# Altium schematic sheet Cascade.SchDoc
size A; SheetNumber: 8; SheetTotal: 9
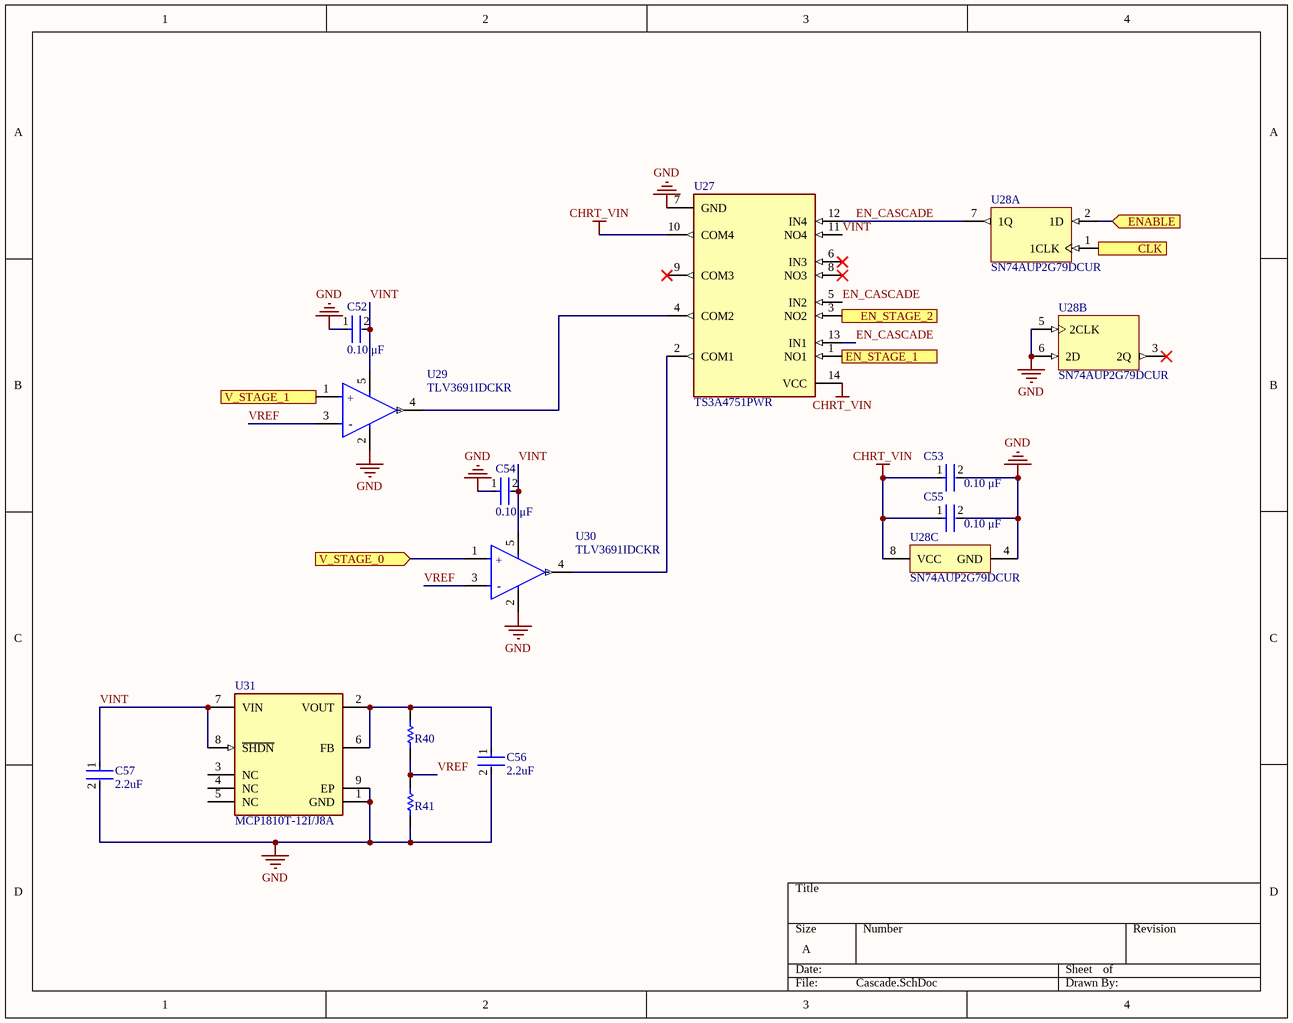
[diagram p0: Cascade.SchDoc]

## Parts
C52  Capacitance: 0.10 μF  [FP-C0402-BB-MFG]  (hidden comment: C0402C104K8PACTU)
C53  Capacitance: 0.10 μF  [FP-C0402-BB-MFG]  (hidden comment: C0402C104K8PACTU)
C54  Capacitance: 0.10 μF  [FP-C0402-BB-MFG]  (hidden comment: C0402C104K8PACTU)
C55  Capacitance: 0.10 μF  [FP-C0402-BB-MFG]  (hidden comment: C0402C104K8PACTU)
C56  Capacitance: 2.2uF  [FP-GRM188-0_1-e0_2_0_5-MFG]  (hidden comment: GRM188R71A225KE15D)
C57  Capacitance: 2.2uF  [FP-GRM188-0_1-e0_2_0_5-MFG]  (hidden comment: GRM188R71A225KE15D)
R40  ERJ-2GEJ915X  [RESC1005X40X25LL05T05]  (value not drawn)
R41  CRCW04022M40FKED  [RESC1005X40X25LL05T05]  (value not drawn)
U27  TS3A4751PWR  [FP-PW0014A-IPC_C]
U28  SN74AUP2G79DCUR  [DCU0008A_L]  (parts A,B,C of 3)
U29  TLV3691IDCKR  [FP-DCK0005A-IPC_A]
U30  TLV3691IDCKR  [FP-DCK0005A-IPC_A]
U31  MCP1810T-12I/J8A  [FP-C04-1207A-MFG]

## Ports
CLK (in), EN_STAGE_1 (in), EN_STAGE_2 (in), ENABLE (in), V_STAGE_0 (in), V_STAGE_1 (in)

## Nets
CHRT_VIN: C53.1 C55.1 U27.10(COM4) U27.14(VCC) U28.8(VCC)
GND: C52.1 C53.2 C54.1 C55.2 C56.2 C57.2 R41.2 U27.7(GND) U28.4(GND) U28.5(2CLK) U28.6(2D) U29.2(GND) U30.2(GND) U31.1(GND) U31.9(EP)
CLK: U28.1(1CLK) ; port CLK
EN_CASCADE: U27.5(IN2) U27.12(IN4) U27.13(IN1) U28.7(1Q)
EN_STAGE_1: U27.1(NO1) ; port EN_STAGE_1
EN_STAGE_2: U27.3(NO2) ; port EN_STAGE_2
ENABLE: U28.2(1D) ; port ENABLE
V_STAGE_0: U30.1(IN+) ; port V_STAGE_0
V_STAGE_1: U29.1(IN+) ; port V_STAGE_1
VINT: C52.2 C54.2 C57.1 U27.11(NO4) U29.5(VCC) U30.5(VCC) U31.7(VIN) U31.8(~{SHDN})
VREF: R40.1 R41.1 U29.3(IN-) U30.3(IN-)
NetC56_1: C56.1 R40.2 U31.2(VOUT) U31.6(FB)
NetU27_2: U27.2(COM1) U30.4(OUT)
NetU27_4: U27.4(COM2) U29.4(OUT)

Not connected (* = marked no-connect by the designer): U27 6(IN3)* 8(NO3)* 9(COM3)*; U28 3(2Q)*; U31 3(NC) 4(NC) 5(NC)

## Notes on the sheet
- (in symbol CMP-04896-000044-1) +; -

## Library data of the parts
C52-C55 = CMP-2008-02046-2: CAP CER 0.1UF 10V X5R 0402; Manufacturer: Kemet; Material: Ceramic; Temperature Coefficient: 15%; Tolerance: 0.1; Value: 0.10 μF; Package: C0402-BB; Temperature: -55°C to +125°C; ComponentLink2Description: Datasheet; Temperature Characteristic: X5R; Device Class L1: Passive Components; Height: 0.55mm; Lead Free: Yes; ComponentLink2URL: https://content.kemet.com/datasheets/KEM_C1002_X7R_SMD.pdf; Device Class L2: Capacitors; Temperature Range Low: -55°C; Temperature Range High: +125°C; RoHS: TRUE; Octopart: https://octopart.com/c0402c104k8pactu-kemet-140039; Automotive: No; Mouser Description: Capacitor 100 nF 10 VDC 0402; Category: Cap; Voltage Rating: 10 V; Digikey Description: CAP CER 0.1UF 10V X5R 0402; Ipc Land Pattern Name: CAPC10050X50; Device Class L3: Ceramic Capacitors; Manufacturer Part Number: C0402C104K8PACTU
C56 C57 = CMP-2006-02836-2: Chip Multilayer Ceramic Capacitors for General Purpose, 0603, 2.2uF, X7R, 15%, 10%, 10V; Case Code (Metric): 1608; Height: 0.8mm; Packaging: Cut Tape; Voltage: 10V; Lead Free: Lead Free; Min Operating Temperature: -55°C; Voltage Rating (DC): 10V; Max Operating Temperature: 125°C; Voltage Rating: 10V; Dielectric: X7R; Depth: 0.8mm; Case Code (Imperial): 0603; Termination: SMD/SMT; Case/Package: 0603; Number of Pins: 2; REACH SVHC: No SVHC; Mount: Surface Mount; Width: 0.031inch; Material: Ceramic; Package Quantity: 1; Weight: 7.1E-05oz; Length: 1.6mm; Thickness: 0.035inch; Tolerance: 10%
R40 = CMP-2002-00597-1: Manufacturer: Panasonic; Part Number: ERJ-2GEJ915X
R41 = CMP-1011-00890-2: Manufacturer: Vishay Dale; Part Number: CRCW04022M40FKED
U27 = CMP-04892-000059-1: IC SWITCH QUAD SPST 14TSSOP; Bandwidth: 125MHz; High Level Output Current: 100mA; Max Supply Voltage: 3.6V; Operating Supply Voltage: 3V; Polarity: Non-Inverting; Turn-Off Delay Time: 9ns; On-State Resistance: 900mR; Supply Type: Single; Max Supply Current: 75nA; Number of Inputs: 4; Turn-On Delay Time: 14ns; Min Supply Voltage: 1.6V; Packaging: Tape and Reel; Contact Plating: Gold; Mount: Surface Mount; Low Level Output Current: 100mA; Termination: SMD/SMT; Min Operating Temperature: -40°C; Case/Package: TSSOP; REACH SVHC: No SVHC; Weight: 0.002018oz; Number of Pins: 14; Throw Configuration: SPST; Height: 1.05mm; Radiation Hardening: No; Length: 5.1mm; Max Operating Temperature: 85°C; Package Quantity: 1; Lead Free: Lead Free; RoHS Compliant: Yes; Number of Channels: 4; Number of Outputs: 4; Width: 4.5mm
U28 = CMP-0859-00716-3: Low-Power Dual Positive-Edge-Triggered D-Type Flip-Flop, DCU0008A, LARGE T&R; Manufacturer: Texas Instruments; ICC @ Nom Voltage(Max)(mA): 0.0009; 3-State Output: No; Input Type: CMOS; Rating: Catalog; Output Drive (IOL/IOH)(Max)(mA): 20/-20; VCC(Max)(V): 3.6; Bits(#): 2; Technology Family: AUP; Logic: True; Voltage(Nom)(V): 0.8,1.2,1.5,1.8,2.5,3.3; VCC(Min)(V): 0.8; tpd @ Nom Voltage(Max)(ns): 27.2,17.3,13.3,11.3,7.8,6.3; F @ Nom Voltage(Max)(Mhz): 100; DatasheetVersion: SCES755C; Generic Part Number: SN74AUP2G79; Sub-Family: D-Type Flip-Flop; PackageReference: DCU0008A; Schmitt Trigger: No; Output Type: CMOS; Operating Temperature Range(C): -40 to 85
U29 U30 = CMP-04896-000044-1: IC COMPARATOR NANO-POWER SC70-5; Max Supply Voltage: 6.5V; Propagation Delay: 35us; Quiescent Current: 150nA; Max Input Current: 100pA; Min Supply Voltage: 900mV; Number of Elements: 1; Min Dual Supply Voltage: 450mV; Max Dual Supply Voltage: 3.25V; Output Current: 42mA; Input Offset Voltage (Vos): 3mV; Response Time: 24us; Packaging: Tape and Reel; Type: General Purpose; RoHS Compliant: Yes; Number of Pins: 5; Max Operating Temperature: 125°C; Input Bias Current: 100pA; Mount: Surface Mount; Radiation Hardening: No; Contact Plating: Gold; Number of Channels: 1; Min Operating Temperature: -40°C; Package Quantity: 3000; Lead Free: Lead Free; Case/Package: SC
U31 = CMP-06324-000006-1: IC REG LINEAR 1.2V 150MA 8VDFN; Manufacturer: Microchip Technology; Number Of Outputs: 1; Max Junction Temp: +150°C; Dropout Voltage: 380mV; Standoff Height: 0mm; Nominal Supply Current: 0.02uA; Min Supply Voltage: 2.5V; Max Supply Voltage: 5.5V; Output Type: Fixed; Temperature: -40°C to +85°C; Output Voltage: 1.2V; Device Class L1: Integrated Circuits (ICs); Digikey Description: IC REG LINEAR 1.2V 150MA 8VDFN; Automotive: No; Manufacturer Part Number: MCP1810T-12I/J8A; Device Class L3: Voltage Regulators - Linear; Temperature Range Low: -40°C; Package: C04-1207A; Temperature Range High: +85°C; Height: 0.9mm; ComponentLink2Description: Datasheet; Ipc Land Pattern Name: DFN200X200X85-8; Octopart: https://octopart.com/mcp1810t-12i%2Fj8a-microchip-75615047; Device Class L2: Power Management ICs; Lead Free: Yes; Category: IC; ComponentLink2URL: http://ww1.microchip.com/downloads/en/DeviceDoc/20005623B.pdf; RoHS: TRUE; Output Current: 150mA